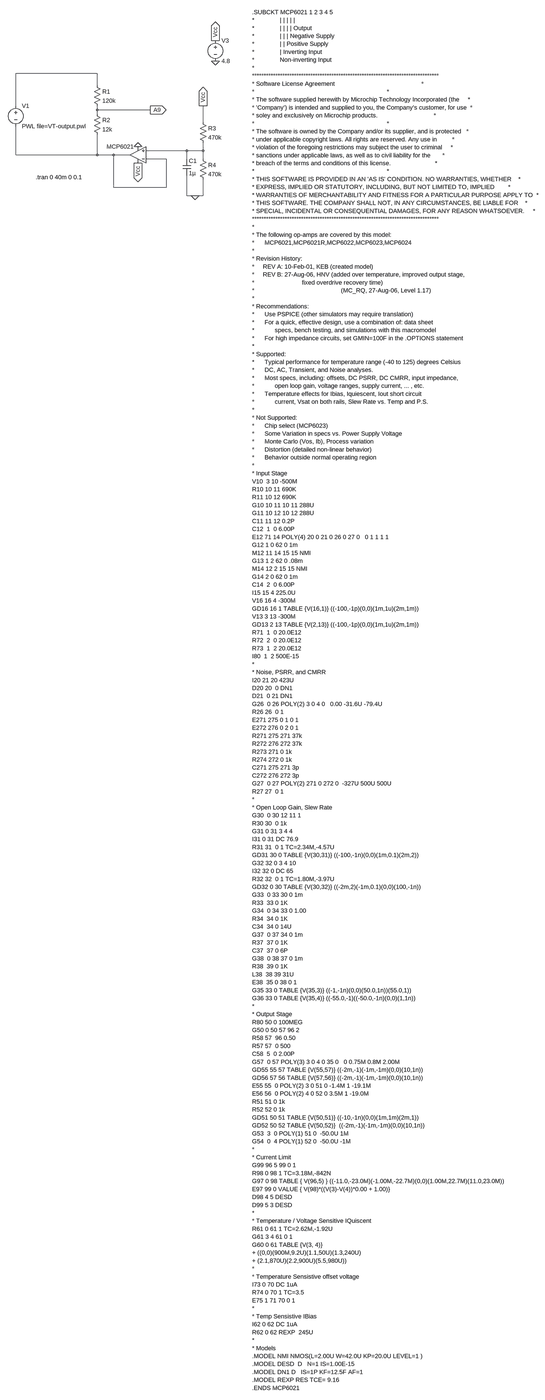
[diagram p0: schematic voltage-sensor-interface.asc, whole sheet]
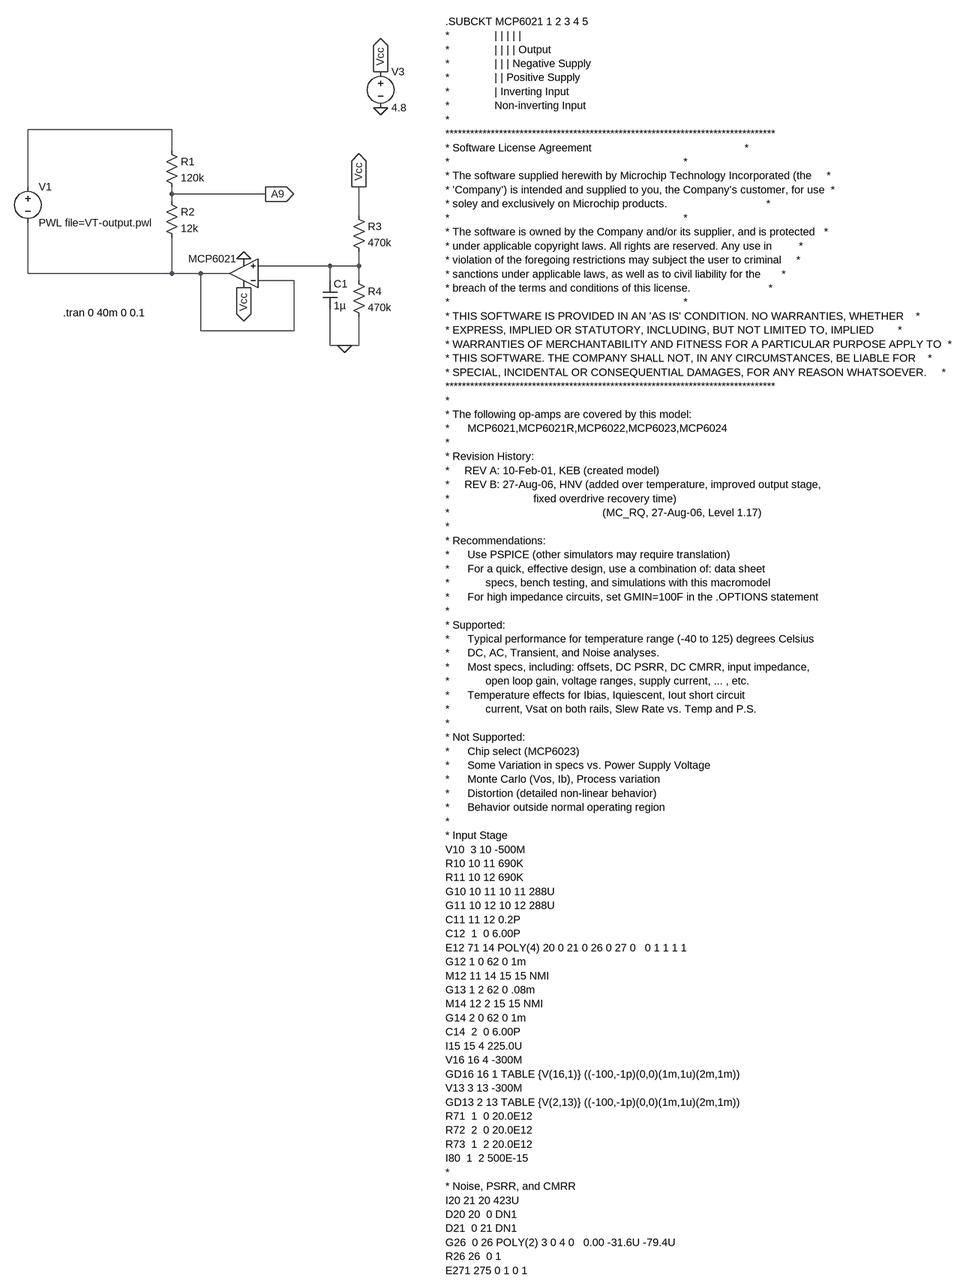
[diagram p1: schematic voltage-sensor-interface.asc, part, row 1 of 2, column 1 of 1]
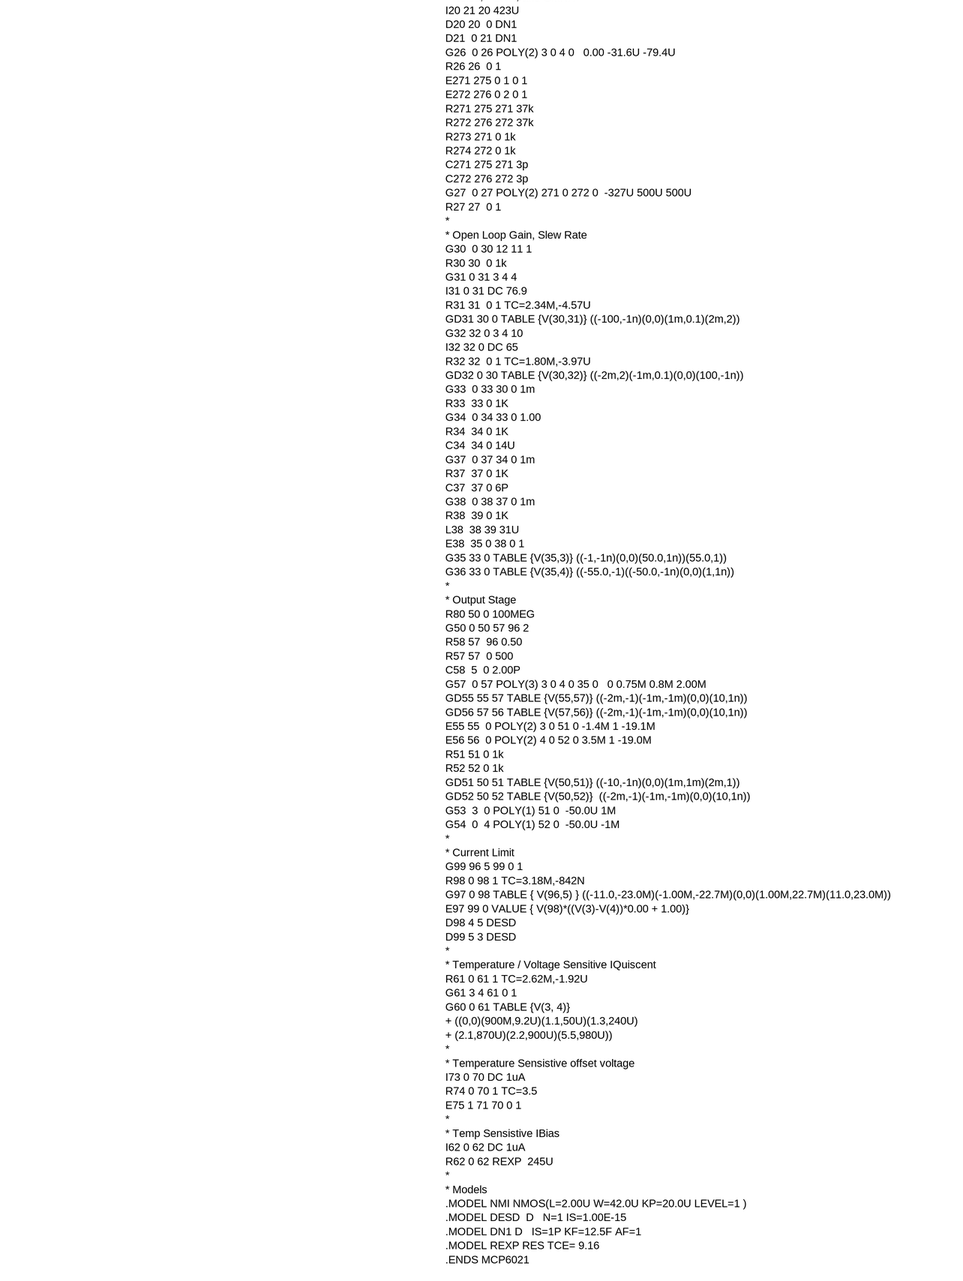
[diagram p2: schematic voltage-sensor-interface.asc, part, row 2 of 2, column 1 of 1]
voltage-sensor-interface.asc, the LTspice schematic file:
Version 4
SHEET 1 1576 4896
WIRE -320 256 -640 256
WIRE -320 304 -320 256
WIRE -640 384 -640 256
WIRE -320 400 -320 384
WIRE -112 400 -320 400
WIRE -320 416 -320 400
WIRE 96 448 96 384
WIRE 32 560 -128 560
WIRE 96 560 96 528
WIRE 96 560 32 560
WIRE -640 576 -640 464
WIRE -320 576 -320 496
WIRE -320 576 -640 576
WIRE -256 576 -320 576
WIRE -192 576 -256 576
WIRE -48 592 -128 592
WIRE 32 592 32 560
WIRE 96 592 96 560
WIRE -256 704 -256 576
WIRE -48 704 -48 592
WIRE -48 704 -256 704
WIRE 32 736 32 656
WIRE 64 736 32 736
WIRE 96 736 96 672
WIRE 96 736 64 736
FLAG -160 544 0
FLAG 64 736 0
FLAG -112 400 A9
IOPIN -112 400 Out
FLAG 144 208 0
FLAG 144 128 Vcc
IOPIN 144 128 Out
FLAG -160 608 Vcc
IOPIN -160 608 Out
FLAG 96 384 Vcc
IOPIN 96 384 Out
SYMBOL voltage -640 368 R0
WINDOW 123 0 0 Left 2
WINDOW 39 0 0 Left 2
SYMATTR InstName V1
SYMATTR Value PWL file=VT-output.pwl
SYMBOL res -336 288 R0
SYMATTR InstName R1
SYMATTR Value 120k
SYMATTR SpiceLine tol=5 pwr=.25
SYMBOL res -336 400 R0
SYMATTR InstName R2
SYMATTR Value 12k
SYMATTR SpiceLine tol=5 pwr=.25
SYMBOL Opamps\\opamp2 -160 640 R180
WINDOW 0 16 32 Invisible 2
SYMATTR InstName u1
SYMATTR Value MCP6021
SYMBOL cap 16 592 R0
SYMATTR InstName C1
SYMATTR Value 1µ
SYMBOL res 80 432 R0
SYMATTR InstName R3
SYMATTR Value 470k
SYMATTR SpiceLine tol=5 pwr=0.25
SYMBOL res 80 576 R0
SYMATTR InstName R4
SYMATTR Value 470k
SYMATTR SpiceLine tol=5 pwr=0.25
SYMBOL voltage 144 112 R0
WINDOW 123 0 0 Left 2
WINDOW 39 0 0 Left 2
SYMATTR InstName V3
SYMATTR Value 4.8
TEXT 288 16 Left 2 !.SUBCKT MCP6021 1 2 3 4 5\n*               | | | | |\n*               | | | | Output\n*               | | | Negative Supply\n*               | | Positive Supply\n*               | Inverting Input\n*               Non-inverting Input\n*\n********************************************************************************\n* Software License Agreement                                                   *\n*                                                                              *\n* The software supplied herewith by Microchip Technology Incorporated (the     *\n* 'Company') is intended and supplied to you, the Company's customer, for use  *\n* soley and exclusively on Microchip products.                                 *\n*                                                                              *\n* The software is owned by the Company and/or its supplier, and is protected   *\n* under applicable copyright laws. All rights are reserved. Any use in         *\n* violation of the foregoing restrictions may subject the user to criminal     *\n* sanctions under applicable laws, as well as to civil liability for the       *\n* breach of the terms and conditions of this license.                          *\n*                                                                              *\n* THIS SOFTWARE IS PROVIDED IN AN 'AS IS' CONDITION. NO WARRANTIES, WHETHER    *\n* EXPRESS, IMPLIED OR STATUTORY, INCLUDING, BUT NOT LIMITED TO, IMPLIED        *\n* WARRANTIES OF MERCHANTABILITY AND FITNESS FOR A PARTICULAR PURPOSE APPLY TO  *\n* THIS SOFTWARE. THE COMPANY SHALL NOT, IN ANY CIRCUMSTANCES, BE LIABLE FOR    *\n* SPECIAL, INCIDENTAL OR CONSEQUENTIAL DAMAGES, FOR ANY REASON WHATSOEVER.     *\n********************************************************************************\n*\n* The following op-amps are covered by this model:\n*      MCP6021,MCP6021R,MCP6022,MCP6023,MCP6024\n*\n* Revision History:\n*     REV A: 10-Feb-01, KEB (created model)\n*     REV B: 27-Aug-06, HNV (added over temperature, improved output stage, \n*                            fixed overdrive recovery time)\n*                                                   (MC_RQ, 27-Aug-06, Level 1.17)       \n*\n* Recommendations:\n*      Use PSPICE (other simulators may require translation)\n*      For a quick, effective design, use a combination of: data sheet\n*            specs, bench testing, and simulations with this macromodel\n*      For high impedance circuits, set GMIN=100F in the .OPTIONS statement\n*\n* Supported:\n*      Typical performance for temperature range (-40 to 125) degrees Celsius\n*      DC, AC, Transient, and Noise analyses.\n*      Most specs, including: offsets, DC PSRR, DC CMRR, input impedance,\n*            open loop gain, voltage ranges, supply current, ... , etc.\n*      Temperature effects for Ibias, Iquiescent, Iout short circuit \n*            current, Vsat on both rails, Slew Rate vs. Temp and P.S.\n*\n* Not Supported:\n*      Chip select (MCP6023)\n*      Some Variation in specs vs. Power Supply Voltage\n*      Monte Carlo (Vos, Ib), Process variation\n*      Distortion (detailed non-linear behavior)\n*      Behavior outside normal operating region\n*\n* Input Stage\nV10  3 10 -500M\nR10 10 11 690K\nR11 10 12 690K\nG10 10 11 10 11 288U\nG11 10 12 10 12 288U\nC11 11 12 0.2P\nC12  1  0 6.00P\nE12 71 14 POLY(4) 20 0 21 0 26 0 27 0   0 1 1 1 1\nG12 1 0 62 0 1m\nM12 11 14 15 15 NMI\nG13 1 2 62 0 .08m \nM14 12 2 15 15 NMI \nG14 2 0 62 0 1m\nC14  2  0 6.00P\nI15 15 4 225.0U\nV16 16 4 -300M\nGD16 16 1 TABLE {V(16,1)} ((-100,-1p)(0,0)(1m,1u)(2m,1m)) \nV13 3 13 -300M\nGD13 2 13 TABLE {V(2,13)} ((-100,-1p)(0,0)(1m,1u)(2m,1m)) \nR71  1  0 20.0E12\nR72  2  0 20.0E12\nR73  1  2 20.0E12\nI80  1  2 500E-15\n*\n* Noise, PSRR, and CMRR\nI20 21 20 423U\nD20 20  0 DN1\nD21  0 21 DN1\nG26  0 26 POLY(2) 3 0 4 0   0.00 -31.6U -79.4U\nR26 26  0 1\nE271 275 0 1 0 1\nE272 276 0 2 0 1\nR271 275 271 37k\nR272 276 272 37k\nR273 271 0 1k\nR274 272 0 1k\nC271 275 271 3p\nC272 276 272 3p\nG27  0 27 POLY(2) 271 0 272 0  -327U 500U 500U\nR27 27  0 1\n*\n* Open Loop Gain, Slew Rate\nG30  0 30 12 11 1\nR30 30  0 1k\nG31 0 31 3 4 4\nI31 0 31 DC 76.9\nR31 31  0 1 TC=2.34M,-4.57U\nGD31 30 0 TABLE {V(30,31)} ((-100,-1n)(0,0)(1m,0.1)(2m,2))\nG32 32 0 3 4 10\nI32 32 0 DC 65\nR32 32  0 1 TC=1.80M,-3.97U\nGD32 0 30 TABLE {V(30,32)} ((-2m,2)(-1m,0.1)(0,0)(100,-1n))\nG33  0 33 30 0 1m\nR33  33 0 1K\nG34  0 34 33 0 1.00\nR34  34 0 1K\nC34  34 0 14U\nG37  0 37 34 0 1m\nR37  37 0 1K\nC37  37 0 6P\nG38  0 38 37 0 1m\nR38  39 0 1K\nL38  38 39 31U\nE38  35 0 38 0 1\nG35 33 0 TABLE {V(35,3)} ((-1,-1n)(0,0)(50.0,1n))(55.0,1))\nG36 33 0 TABLE {V(35,4)} ((-55.0,-1)((-50.0,-1n)(0,0)(1,1n))\n*\n* Output Stage\nR80 50 0 100MEG\nG50 0 50 57 96 2\nR58 57  96 0.50\nR57 57  0 500\nC58  5  0 2.00P\nG57  0 57 POLY(3) 3 0 4 0 35 0   0 0.75M 0.8M 2.00M\nGD55 55 57 TABLE {V(55,57)} ((-2m,-1)(-1m,-1m)(0,0)(10,1n))\nGD56 57 56 TABLE {V(57,56)} ((-2m,-1)(-1m,-1m)(0,0)(10,1n))\nE55 55  0 POLY(2) 3 0 51 0 -1.4M 1 -19.1M\nE56 56  0 POLY(2) 4 0 52 0 3.5M 1 -19.0M\nR51 51 0 1k\nR52 52 0 1k\nGD51 50 51 TABLE {V(50,51)} ((-10,-1n)(0,0)(1m,1m)(2m,1))\nGD52 50 52 TABLE {V(50,52)}  ((-2m,-1)(-1m,-1m)(0,0)(10,1n))\nG53  3  0 POLY(1) 51 0  -50.0U 1M\nG54  0  4 POLY(1) 52 0  -50.0U -1M\n*\n* Current Limit\nG99 96 5 99 0 1\nR98 0 98 1 TC=3.18M,-842N\nG97 0 98 TABLE { V(96,5) } ((-11.0,-23.0M)(-1.00M,-22.7M)(0,0)(1.00M,22.7M)(11.0,23.0M))\nE97 99 0 VALUE { V(98)*((V(3)-V(4))*0.00 + 1.00)}\nD98 4 5 DESD\nD99 5 3 DESD\n*\n* Temperature / Voltage Sensitive IQuiscent\nR61 0 61 1 TC=2.62M,-1.92U\nG61 3 4 61 0 1\nG60 0 61 TABLE {V(3, 4)} \n+ ((0,0)(900M,9.2U)(1.1,50U)(1.3,240U)\n+ (2.1,870U)(2.2,900U)(5.5,980U))\n*\n* Temperature Sensistive offset voltage\nI73 0 70 DC 1uA\nR74 0 70 1 TC=3.5\nE75 1 71 70 0 1 \n*\n* Temp Sensistive IBias\nI62 0 62 DC 1uA\nR62 0 62 REXP  245U\n*\n* Models\n.MODEL NMI NMOS(L=2.00U W=42.0U KP=20.0U LEVEL=1 )\n.MODEL DESD  D   N=1 IS=1.00E-15\n.MODEL DN1 D   IS=1P KF=12.5F AF=1\n.MODEL REXP RES TCE= 9.16\n.ENDS MCP6021
TEXT -562 664 Left 2 !.tran 0 40m 0 0.1

The netlist it stands for:
* voltage-sensor-interface.asc
V1 N001 N003 PWL file=VT-output.pwl
R1 N001 A9 120k tol=5 pwr=.25
R2 A9 N003 12k tol=5 pwr=.25
Xu1 N002 N003 Vcc 0 N003 MCP6021  ; pins In+ In- V+ V- OUT
C1 N002 0 1µ
R3 Vcc N002 470k tol=5 pwr=0.25
R4 N002 0 470k tol=5 pwr=0.25
V3 Vcc 0 4.8
.SUBCKT MCP6021 1 2 3 4 5
*               | | | | |
*               | | | | Output
*               | | | Negative Supply
*               | | Positive Supply
*               | Inverting Input
*               Non-inverting Input
*
********************************************************************************
* Software License Agreement                                                   *
*                                                                              *
* The software supplied herewith by Microchip Technology Incorporated (the     *
* 'Company') is intended and supplied to you, the Company's customer, for use  *
* soley and exclusively on Microchip products.                                 *
*                                                                              *
* The software is owned by the Company and/or its supplier, and is protected   *
* under applicable copyright laws. All rights are reserved. Any use in         *
* violation of the foregoing restrictions may subject the user to criminal     *
* sanctions under applicable laws, as well as to civil liability for the       *
* breach of the terms and conditions of this license.                          *
*                                                                              *
* THIS SOFTWARE IS PROVIDED IN AN 'AS IS' CONDITION. NO WARRANTIES, WHETHER    *
* EXPRESS, IMPLIED OR STATUTORY, INCLUDING, BUT NOT LIMITED TO, IMPLIED        *
* WARRANTIES OF MERCHANTABILITY AND FITNESS FOR A PARTICULAR PURPOSE APPLY TO  *
* THIS SOFTWARE. THE COMPANY SHALL NOT, IN ANY CIRCUMSTANCES, BE LIABLE FOR    *
* SPECIAL, INCIDENTAL OR CONSEQUENTIAL DAMAGES, FOR ANY REASON WHATSOEVER.     *
********************************************************************************
*
* The following op-amps are covered by this model:
*      MCP6021,MCP6021R,MCP6022,MCP6023,MCP6024
*
* Revision History:
*     REV A: 10-Feb-01, KEB (created model)
*     REV B: 27-Aug-06, HNV (added over temperature, improved output stage,
*                            fixed overdrive recovery time)
*                                                   (MC_RQ, 27-Aug-06, Level 1.17)
*
* Recommendations:
*      Use PSPICE (other simulators may require translation)
*      For a quick, effective design, use a combination of: data sheet
*            specs, bench testing, and simulations with this macromodel
*      For high impedance circuits, set GMIN=100F in the .OPTIONS statement
*
* Supported:
*      Typical performance for temperature range (-40 to 125) degrees Celsius
*      DC, AC, Transient, and Noise analyses.
*      Most specs, including: offsets, DC PSRR, DC CMRR, input impedance,
*            open loop gain, voltage ranges, supply current, ... , etc.
*      Temperature effects for Ibias, Iquiescent, Iout short circuit
*            current, Vsat on both rails, Slew Rate vs. Temp and P.S.
*
* Not Supported:
*      Chip select (MCP6023)
*      Some Variation in specs vs. Power Supply Voltage
*      Monte Carlo (Vos, Ib), Process variation
*      Distortion (detailed non-linear behavior)
*      Behavior outside normal operating region
*
* Input Stage
V10  3 10 -500M
R10 10 11 690K
R11 10 12 690K
G10 10 11 10 11 288U
G11 10 12 10 12 288U
C11 11 12 0.2P
C12  1  0 6.00P
E12 71 14 POLY(4) 20 0 21 0 26 0 27 0   0 1 1 1 1
G12 1 0 62 0 1m
M12 11 14 15 15 NMI
G13 1 2 62 0 .08m
M14 12 2 15 15 NMI
G14 2 0 62 0 1m
C14  2  0 6.00P
I15 15 4 225.0U
V16 16 4 -300M
GD16 16 1 TABLE {V(16,1)} ((-100,-1p)(0,0)(1m,1u)(2m,1m))
V13 3 13 -300M
GD13 2 13 TABLE {V(2,13)} ((-100,-1p)(0,0)(1m,1u)(2m,1m))
R71  1  0 20.0E12
R72  2  0 20.0E12
R73  1  2 20.0E12
I80  1  2 500E-15
*
* Noise, PSRR, and CMRR
I20 21 20 423U
D20 20  0 DN1
D21  0 21 DN1
G26  0 26 POLY(2) 3 0 4 0   0.00 -31.6U -79.4U
R26 26  0 1
E271 275 0 1 0 1
E272 276 0 2 0 1
R271 275 271 37k
R272 276 272 37k
R273 271 0 1k
R274 272 0 1k
C271 275 271 3p
C272 276 272 3p
G27  0 27 POLY(2) 271 0 272 0  -327U 500U 500U
R27 27  0 1
*
* Open Loop Gain, Slew Rate
G30  0 30 12 11 1
R30 30  0 1k
G31 0 31 3 4 4
I31 0 31 DC 76.9
R31 31  0 1 TC=2.34M,-4.57U
GD31 30 0 TABLE {V(30,31)} ((-100,-1n)(0,0)(1m,0.1)(2m,2))
G32 32 0 3 4 10
I32 32 0 DC 65
R32 32  0 1 TC=1.80M,-3.97U
GD32 0 30 TABLE {V(30,32)} ((-2m,2)(-1m,0.1)(0,0)(100,-1n))
G33  0 33 30 0 1m
R33  33 0 1K
G34  0 34 33 0 1.00
R34  34 0 1K
C34  34 0 14U
G37  0 37 34 0 1m
R37  37 0 1K
C37  37 0 6P
G38  0 38 37 0 1m
R38  39 0 1K
L38  38 39 31U
E38  35 0 38 0 1
G35 33 0 TABLE {V(35,3)} ((-1,-1n)(0,0)(50.0,1n))(55.0,1))
G36 33 0 TABLE {V(35,4)} ((-55.0,-1)((-50.0,-1n)(0,0)(1,1n))
*
* Output Stage
R80 50 0 100MEG
G50 0 50 57 96 2
R58 57  96 0.50
R57 57  0 500
C58  5  0 2.00P
G57  0 57 POLY(3) 3 0 4 0 35 0   0 0.75M 0.8M 2.00M
GD55 55 57 TABLE {V(55,57)} ((-2m,-1)(-1m,-1m)(0,0)(10,1n))
GD56 57 56 TABLE {V(57,56)} ((-2m,-1)(-1m,-1m)(0,0)(10,1n))
E55 55  0 POLY(2) 3 0 51 0 -1.4M 1 -19.1M
E56 56  0 POLY(2) 4 0 52 0 3.5M 1 -19.0M
R51 51 0 1k
R52 52 0 1k
GD51 50 51 TABLE {V(50,51)} ((-10,-1n)(0,0)(1m,1m)(2m,1))
GD52 50 52 TABLE {V(50,52)}  ((-2m,-1)(-1m,-1m)(0,0)(10,1n))
G53  3  0 POLY(1) 51 0  -50.0U 1M
G54  0  4 POLY(1) 52 0  -50.0U -1M
*
* Current Limit
G99 96 5 99 0 1
R98 0 98 1 TC=3.18M,-842N
G97 0 98 TABLE { V(96,5) } ((-11.0,-23.0M)(-1.00M,-22.7M)(0,0)(1.00M,22.7M)(11.0,23.0M))
E97 99 0 VALUE { V(98)*((V(3)-V(4))*0.00 + 1.00)}
D98 4 5 DESD
D99 5 3 DESD
*
* Temperature / Voltage Sensitive IQuiscent
R61 0 61 1 TC=2.62M,-1.92U
G61 3 4 61 0 1
G60 0 61 TABLE {V(3, 4)}
+ ((0,0)(900M,9.2U)(1.1,50U)(1.3,240U)
+ (2.1,870U)(2.2,900U)(5.5,980U))
*
* Temperature Sensistive offset voltage
I73 0 70 DC 1uA
R74 0 70 1 TC=3.5
E75 1 71 70 0 1
*
* Temp Sensistive IBias
I62 0 62 DC 1uA
R62 0 62 REXP  245U
*
* Models
.MODEL NMI NMOS(L=2.00U W=42.0U KP=20.0U LEVEL=1 )
.MODEL DESD  D   N=1 IS=1.00E-15
.MODEL DN1 D   IS=1P KF=12.5F AF=1
.MODEL REXP RES TCE= 9.16
.ENDS MCP6021
.tran 0 40m 0 0.1
.backanno
.end